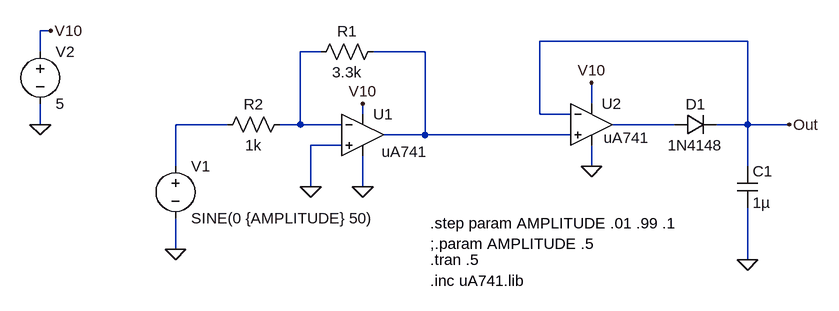
[diagram p0: schematic For-STC013.asc]
For-STC013.asc, the LTspice schematic file:
Version 4
SHEET 1 1500 680
WIRE 32 -16 16 -16
WIRE 1104 0 784 0
WIRE 16 16 16 -16
WIRE 448 16 416 16
WIRE 608 16 528 16
WIRE 864 96 864 64
WIRE 512 112 512 96
WIRE 784 112 784 0
WIRE 832 112 784 112
WIRE 16 128 16 96
WIRE 304 128 224 128
WIRE 416 128 416 16
WIRE 416 128 384 128
WIRE 480 128 416 128
WIRE 992 128 896 128
WIRE 1104 128 1104 0
WIRE 1104 128 1056 128
WIRE 1168 128 1104 128
WIRE 608 144 608 16
WIRE 608 144 544 144
WIRE 832 144 608 144
WIRE 480 160 432 160
WIRE 224 192 224 128
WIRE 864 192 864 160
WIRE 1104 192 1104 128
WIRE 432 224 432 160
WIRE 512 224 512 176
WIRE 224 320 224 272
WIRE 1104 336 1104 256
FLAG 224 320 0
FLAG 32 -16 V10
FLAG 512 96 V10
FLAG 1168 128 Out
FLAG 864 192 0
FLAG 864 64 V10
FLAG 1104 336 0
FLAG 512 224 0
FLAG 432 224 0
FLAG 16 128 0
SYMBOL voltage 224 176 R0
WINDOW 123 0 0 Left 0
WINDOW 39 0 0 Left 0
SYMATTR InstName V1
SYMATTR Value SINE(0 {AMPLITUDE} 50)
SYMBOL voltage 16 0 R0
WINDOW 123 0 0 Left 0
WINDOW 39 0 0 Left 0
SYMATTR InstName V2
SYMATTR Value 5
SYMBOL OpAmps\\UniversalOpAmp 512 144 R0
WINDOW 3 29 26 Left 2
SYMATTR Value uA741
SYMATTR InstName U1
SYMATTR SpiceModel ""
SYMATTR Value2 ""
SYMATTR SpiceLine ""
SYMBOL res 544 0 R90
WINDOW 0 0 56 VBottom 2
WINDOW 3 32 56 VTop 2
SYMATTR InstName R1
SYMATTR Value 3.3k
SYMBOL res 400 112 R90
WINDOW 0 0 56 VBottom 2
WINDOW 3 32 56 VTop 2
SYMATTR InstName R2
SYMATTR Value 1k
SYMBOL OpAmps\\UniversalOpAmp 864 128 R0
WINDOW 3 19 20 Left 2
SYMATTR Value uA741
SYMATTR InstName U2
SYMATTR SpiceModel ""
SYMBOL diode 992 144 R270
WINDOW 0 32 32 VTop 2
WINDOW 3 0 32 VBottom 2
SYMATTR InstName D1
SYMATTR Value 1N4148
SYMBOL cap 1088 192 R0
SYMATTR InstName C1
SYMATTR Value 1µ
TEXT 616 336 Left 2 !.tran .5
TEXT 616 368 Left 2 !.inc uA741.lib
TEXT 616 280 Left 2 !.step param AMPLITUDE .01 .99 .1\n;.param AMPLITUDE .5

The netlist it stands for:
* For-STC013.asc
V1 N003 0 SINE(0 {AMPLITUDE} 50)
V2 V10 0 5
XU1 0 N001 V10 0 N002 uA741  ; pins In+ In- V+ V- OUT
R1 N002 N001 3.3k
R2 N001 N003 1k
XU2 N002 Out V10 0 N004 uA741 Avol=1Meg GBW=10Meg Vos=0 En=0 Enk=0 In=0 Ink=0 Rin=500Meg  ; pins In+ In- V+ V- OUT
D1 N004 Out 1N4148
C1 Out 0 1µ
.model D D
.lib standard.dio
.tran .5
.inc uA741.lib
.step param AMPLITUDE .01 .99 .1
;.param AMPLITUDE .5
.lib UniversalOpAmp1.lib
.backanno
.end